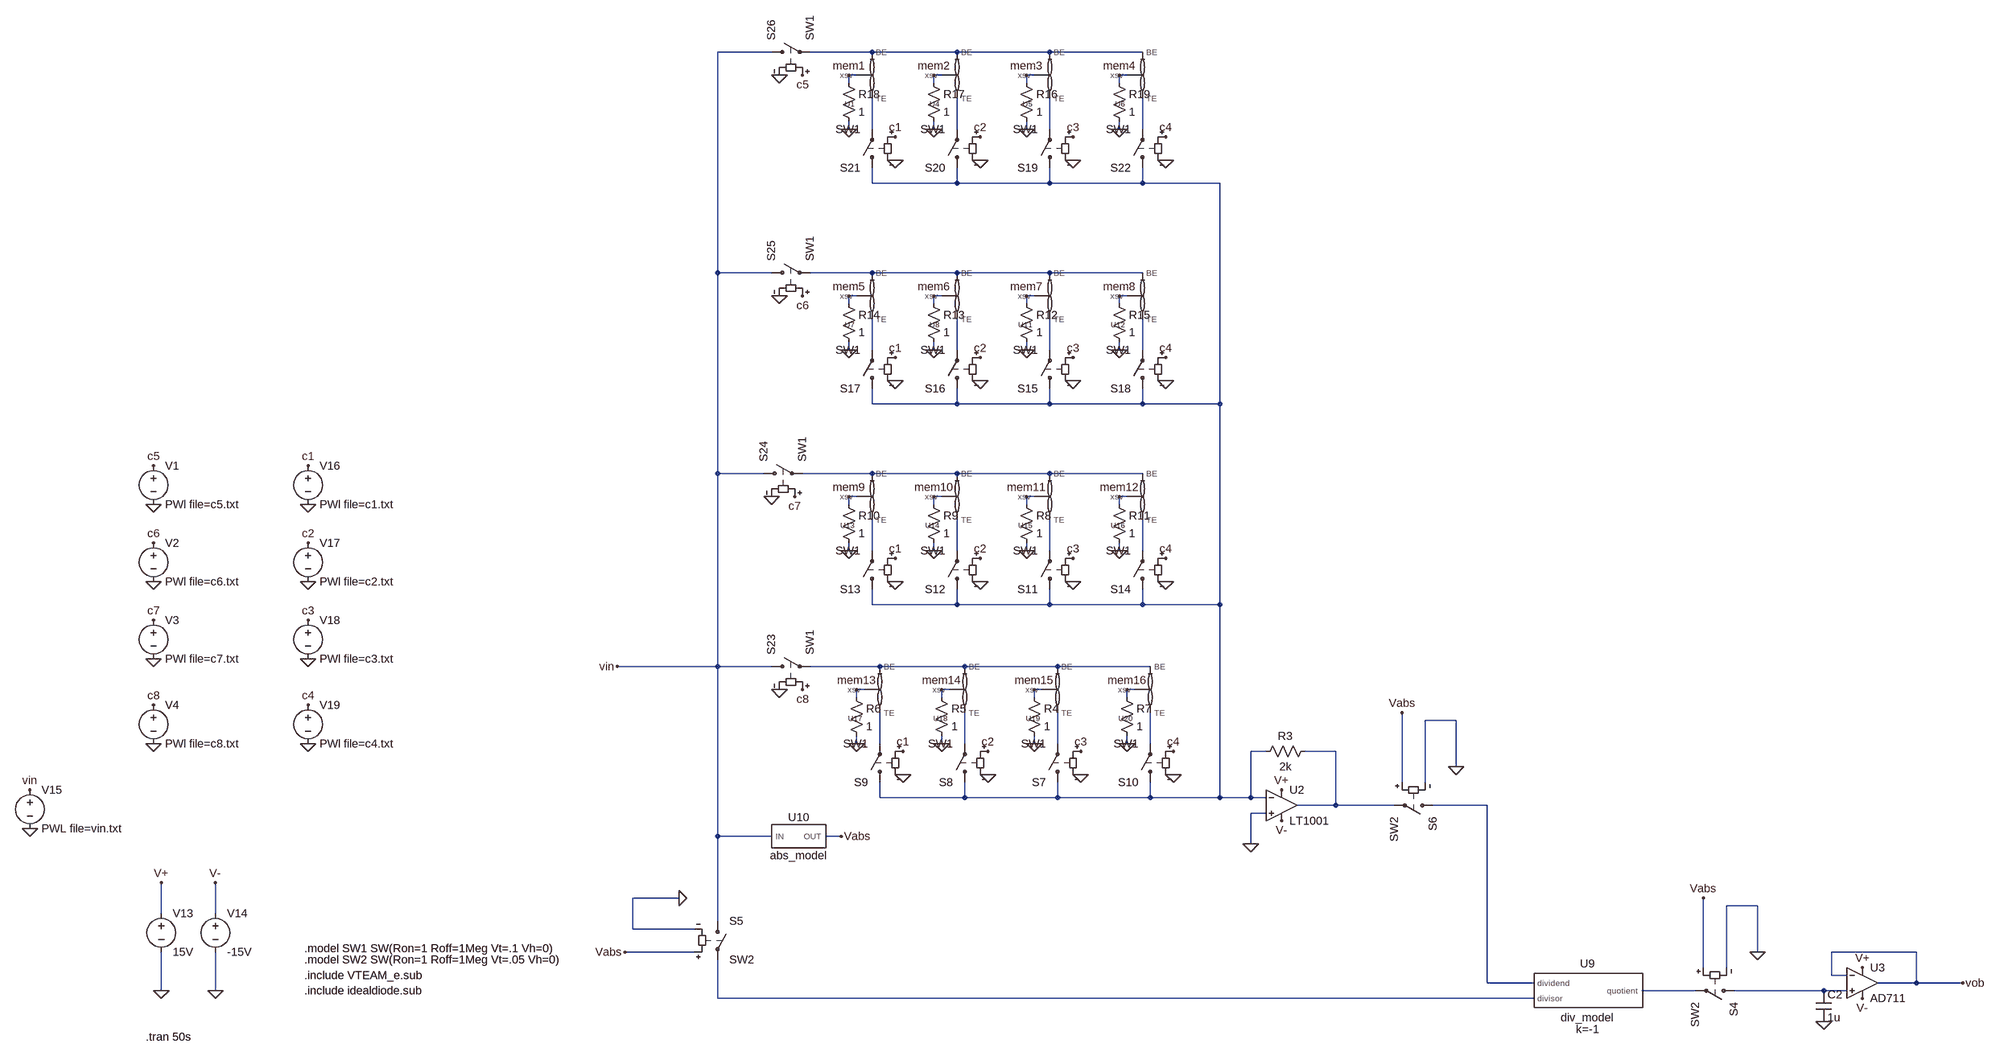
[diagram p0: schematic mem_array.asc]
mem_array.asc, the LTspice schematic file:
Version 4
SHEET 1 4180 3648
WIRE 256 1584 144 1584
WIRE 464 1584 336 1584
WIRE 640 1584 464 1584
WIRE 832 1584 640 1584
WIRE 1024 1584 832 1584
WIRE 432 1632 416 1632
WIRE 608 1632 592 1632
WIRE 800 1632 784 1632
WIRE 992 1632 976 1632
WIRE 416 1648 416 1632
WIRE 592 1648 592 1632
WIRE 784 1648 784 1632
WIRE 976 1648 976 1632
WIRE 416 1744 416 1728
WIRE 464 1744 464 1680
WIRE 592 1744 592 1728
WIRE 640 1744 640 1680
WIRE 784 1744 784 1728
WIRE 832 1744 832 1680
WIRE 976 1744 976 1728
WIRE 1024 1744 1024 1680
WIRE 464 1856 464 1824
WIRE 640 1856 640 1824
WIRE 640 1856 464 1856
WIRE 832 1856 832 1824
WIRE 832 1856 640 1856
WIRE 1024 1856 1024 1824
WIRE 1024 1856 832 1856
WIRE 1184 1856 1024 1856
WIRE 144 2048 144 1584
WIRE 256 2048 144 2048
WIRE 464 2048 336 2048
WIRE 640 2048 464 2048
WIRE 832 2048 640 2048
WIRE 1024 2048 832 2048
WIRE 432 2096 416 2096
WIRE 608 2096 592 2096
WIRE 800 2096 784 2096
WIRE 992 2096 976 2096
WIRE 416 2112 416 2096
WIRE 592 2112 592 2096
WIRE 784 2112 784 2096
WIRE 976 2112 976 2096
WIRE 416 2208 416 2192
WIRE 464 2208 464 2144
WIRE 592 2208 592 2192
WIRE 640 2208 640 2144
WIRE 784 2208 784 2192
WIRE 832 2208 832 2144
WIRE 976 2208 976 2192
WIRE 1024 2208 1024 2144
WIRE 464 2320 464 2288
WIRE 640 2320 640 2288
WIRE 640 2320 464 2320
WIRE 832 2320 832 2288
WIRE 832 2320 640 2320
WIRE 1024 2320 1024 2288
WIRE 1024 2320 832 2320
WIRE 1184 2320 1184 1856
WIRE 1184 2320 1024 2320
WIRE 144 2464 144 2048
WIRE 240 2464 144 2464
WIRE 464 2464 320 2464
WIRE 640 2464 464 2464
WIRE 832 2464 640 2464
WIRE 1024 2464 832 2464
WIRE 432 2512 416 2512
WIRE 608 2512 592 2512
WIRE 800 2512 784 2512
WIRE 992 2512 976 2512
WIRE 416 2528 416 2512
WIRE 592 2528 592 2512
WIRE 784 2528 784 2512
WIRE 976 2528 976 2512
WIRE 416 2624 416 2608
WIRE 464 2624 464 2560
WIRE 592 2624 592 2608
WIRE 640 2624 640 2560
WIRE 784 2624 784 2608
WIRE 832 2624 832 2560
WIRE 976 2624 976 2608
WIRE 1024 2624 1024 2560
WIRE 464 2736 464 2704
WIRE 640 2736 640 2704
WIRE 640 2736 464 2736
WIRE 832 2736 832 2704
WIRE 832 2736 640 2736
WIRE 1024 2736 1024 2704
WIRE 1024 2736 832 2736
WIRE 1184 2736 1184 2320
WIRE 1184 2736 1024 2736
WIRE 144 2864 144 2464
WIRE 144 2864 -64 2864
WIRE 256 2864 144 2864
WIRE 480 2864 336 2864
WIRE 656 2864 480 2864
WIRE 848 2864 656 2864
WIRE 1040 2864 848 2864
WIRE 448 2912 432 2912
WIRE 624 2912 608 2912
WIRE 816 2912 800 2912
WIRE 1008 2912 992 2912
WIRE 432 2928 432 2912
WIRE 608 2928 608 2912
WIRE 800 2928 800 2912
WIRE 992 2928 992 2912
WIRE 1680 2976 1616 2976
WIRE 432 3024 432 3008
WIRE 480 3024 480 2960
WIRE 608 3024 608 3008
WIRE 656 3024 656 2960
WIRE 800 3024 800 3008
WIRE 848 3024 848 2960
WIRE 992 3024 992 3008
WIRE 1040 3024 1040 2960
WIRE 1280 3040 1248 3040
WIRE 1424 3040 1360 3040
WIRE 1680 3072 1680 2976
WIRE 1568 3104 1568 2960
WIRE 1616 3104 1616 2976
WIRE 480 3136 480 3104
WIRE 656 3136 656 3104
WIRE 656 3136 480 3136
WIRE 848 3136 848 3104
WIRE 848 3136 656 3136
WIRE 1040 3136 1040 3104
WIRE 1040 3136 848 3136
WIRE 1184 3136 1184 2736
WIRE 1184 3136 1040 3136
WIRE 1248 3136 1248 3040
WIRE 1248 3136 1184 3136
WIRE 1280 3136 1248 3136
WIRE 1424 3152 1424 3040
WIRE 1424 3152 1344 3152
WIRE 1552 3152 1424 3152
WIRE 1744 3152 1632 3152
WIRE 1280 3168 1248 3168
WIRE 144 3216 144 2864
WIRE 256 3216 144 3216
WIRE 400 3216 368 3216
WIRE 1248 3232 1248 3168
WIRE 64 3344 -32 3344
WIRE 2304 3360 2240 3360
WIRE -1008 3376 -1008 3312
WIRE -896 3376 -896 3312
WIRE 144 3392 144 3216
WIRE -32 3408 -32 3344
WIRE 96 3408 -32 3408
WIRE 96 3456 -48 3456
WIRE 2304 3456 2304 3360
WIRE 2640 3456 2464 3456
WIRE 2192 3488 2192 3344
WIRE 2240 3488 2240 3360
WIRE 2464 3504 2464 3456
WIRE 2496 3504 2464 3504
WIRE 1744 3520 1744 3152
WIRE 1840 3520 1744 3520
WIRE 2640 3520 2640 3456
WIRE 2640 3520 2560 3520
WIRE 2736 3520 2640 3520
WIRE -1008 3536 -1008 3456
WIRE -896 3536 -896 3456
WIRE 2176 3536 2064 3536
WIRE 2448 3536 2256 3536
WIRE 2496 3536 2448 3536
WIRE 144 3552 144 3472
WIRE 1840 3552 144 3552
FLAG 2304 3456 0
FLAG 2528 3488 V+
FLAG 2528 3552 V-
FLAG 64 3344 0
FLAG 1680 3072 0
FLAG 400 3216 Vabs
FLAG -48 3456 Vabs
FLAG 1568 2960 Vabs
FLAG 2192 3344 Vabs
FLAG 1248 3232 0
FLAG -896 3536 0
FLAG -1008 3536 0
FLAG -1008 3312 V+
FLAG -896 3312 V-
FLAG 1312 3120 V+
FLAG 1312 3184 V-
FLAG -1280 3200 0
FLAG -1280 3120 vin
FLAG -704 2528 0
FLAG -704 2688 0
FLAG -704 2848 0
FLAG -704 2448 c1
FLAG -704 2608 c2
FLAG -704 2768 c3
FLAG -64 2864 vin
FLAG 2448 3600 0
FLAG 800 3024 0
FLAG 896 3088 0
FLAG 896 3040 c3
FLAG 608 3024 0
FLAG 704 3088 0
FLAG 704 3040 c2
FLAG 432 3024 0
FLAG 528 3088 0
FLAG 528 3040 c1
FLAG 992 3024 0
FLAG 1088 3088 0
FLAG 1088 3040 c4
FLAG -704 3024 0
FLAG -704 2944 c4
FLAG 784 2624 0
FLAG 880 2688 0
FLAG 880 2640 c3
FLAG 592 2624 0
FLAG 688 2688 0
FLAG 688 2640 c2
FLAG 416 2624 0
FLAG 512 2688 0
FLAG 512 2640 c1
FLAG 976 2624 0
FLAG 1072 2688 0
FLAG 1072 2640 c4
FLAG 784 2208 0
FLAG 880 2272 0
FLAG 880 2224 c3
FLAG 592 2208 0
FLAG 688 2272 0
FLAG 688 2224 c2
FLAG 416 2208 0
FLAG 512 2272 0
FLAG 512 2224 c1
FLAG 976 2208 0
FLAG 1072 2272 0
FLAG 1072 2224 c4
FLAG 784 1744 0
FLAG 880 1808 0
FLAG 880 1760 c3
FLAG 592 1744 0
FLAG 688 1808 0
FLAG 688 1760 c2
FLAG 416 1744 0
FLAG 512 1808 0
FLAG 512 1760 c1
FLAG 976 1744 0
FLAG 1072 1808 0
FLAG 1072 1760 c4
FLAG 272 2912 0
FLAG 320 2912 c8
FLAG 256 2512 0
FLAG 304 2512 c7
FLAG 272 2096 0
FLAG 320 2096 c6
FLAG 272 1632 0
FLAG 320 1632 c5
FLAG -1024 2528 0
FLAG -1024 2688 0
FLAG -1024 2848 0
FLAG -1024 2448 c5
FLAG -1024 2608 c6
FLAG -1024 2768 c7
FLAG -1024 3024 0
FLAG -1024 2944 c8
FLAG 2736 3520 vob
FLAG 416 1632 mem1
FLAG 592 1632 mem2
FLAG 784 1632 mem3
FLAG 976 1632 mem4
FLAG 416 2096 mem5
FLAG 592 2096 mem6
FLAG 784 2096 mem7
FLAG 976 2096 mem8
FLAG 416 2512 mem9
FLAG 592 2512 mem10
FLAG 784 2512 mem11
FLAG 976 2512 mem12
FLAG 432 2912 mem13
FLAG 608 2912 mem14
FLAG 800 2912 mem15
FLAG 992 2912 mem16
SYMBOL OpAmps\\LT1001 1312 3088 R0
SYMATTR InstName U2
SYMBOL res 1376 3024 R90
WINDOW 0 0 56 VBottom 2
WINDOW 3 32 56 VTop 2
SYMATTR InstName R3
SYMATTR Value 2k
SYMBOL OpAmps\\AD711 2528 3456 R0
SYMATTR InstName U3
SYMBOL sw 2272 3536 R90
SYMATTR InstName S4
SYMATTR Value SW2
SYMBOL sw 144 3376 R0
SYMATTR InstName S5
SYMATTR Value SW2
SYMBOL sw 1648 3152 R90
SYMATTR InstName S6
SYMATTR Value SW2
SYMBOL AutoGenerated\\div_model 1952 3536 R0
SYMATTR InstName U9
SYMATTR SpiceLine k=-1
SYMBOL AutoGenerated\\abs_model 304 3216 R0
SYMATTR InstName U10
SYMBOL voltage -1008 3360 R0
SYMATTR InstName V13
SYMATTR Value 15V
SYMBOL voltage -896 3360 R0
WINDOW 123 0 0 Left 0
WINDOW 39 0 0 Left 0
SYMATTR InstName V14
SYMATTR Value -15V
SYMBOL voltage -1280 3104 R0
WINDOW 123 0 0 Left 0
WINDOW 39 0 0 Left 0
SYMATTR InstName V15
SYMATTR Value PWL file=vin.txt
SYMBOL voltage -704 2432 R0
WINDOW 123 0 0 Left 0
WINDOW 39 0 0 Left 0
SYMATTR InstName V16
SYMATTR Value PWl file=c1.txt
SYMBOL voltage -704 2592 R0
WINDOW 123 0 0 Left 0
WINDOW 39 0 0 Left 0
SYMATTR InstName V17
SYMATTR Value PWl file=c2.txt
SYMBOL voltage -704 2752 R0
SYMATTR InstName V18
SYMATTR Value PWl file=c3.txt
SYMBOL cap 2432 3536 R0
SYMATTR InstName C2
SYMATTR Value 1u
SYMBOL res 784 2912 R0
SYMATTR InstName R4
SYMATTR Value 1
SYMBOL sw 848 3120 R180
SYMATTR InstName S7
SYMATTR Value SW1
SYMBOL res 592 2912 R0
SYMATTR InstName R5
SYMATTR Value 1
SYMBOL sw 656 3120 R180
SYMATTR InstName S8
SYMATTR Value SW1
SYMBOL res 416 2912 R0
SYMATTR InstName R6
SYMATTR Value 1
SYMBOL sw 480 3120 R180
SYMATTR InstName S9
SYMATTR Value SW1
SYMBOL res 976 2912 R0
SYMATTR InstName R7
SYMATTR Value 1
SYMBOL sw 1040 3120 R180
SYMATTR InstName S10
SYMATTR Value SW1
SYMBOL voltage -704 2928 R0
SYMATTR InstName V19
SYMATTR Value PWl file=c4.txt
SYMBOL res 768 2512 R0
SYMATTR InstName R8
SYMATTR Value 1
SYMBOL sw 832 2720 R180
SYMATTR InstName S11
SYMATTR Value SW1
SYMBOL res 576 2512 R0
SYMATTR InstName R9
SYMATTR Value 1
SYMBOL sw 640 2720 R180
SYMATTR InstName S12
SYMATTR Value SW1
SYMBOL res 400 2512 R0
SYMATTR InstName R10
SYMATTR Value 1
SYMBOL sw 464 2720 R180
SYMATTR InstName S13
SYMATTR Value SW1
SYMBOL res 960 2512 R0
SYMATTR InstName R11
SYMATTR Value 1
SYMBOL sw 1024 2720 R180
SYMATTR InstName S14
SYMATTR Value SW1
SYMBOL res 768 2096 R0
SYMATTR InstName R12
SYMATTR Value 1
SYMBOL sw 832 2304 R180
SYMATTR InstName S15
SYMATTR Value SW1
SYMBOL res 576 2096 R0
SYMATTR InstName R13
SYMATTR Value 1
SYMBOL sw 640 2304 R180
SYMATTR InstName S16
SYMATTR Value SW1
SYMBOL res 400 2096 R0
SYMATTR InstName R14
SYMATTR Value 1
SYMBOL sw 464 2304 R180
SYMATTR InstName S17
SYMATTR Value SW1
SYMBOL res 960 2096 R0
SYMATTR InstName R15
SYMATTR Value 1
SYMBOL sw 1024 2304 R180
SYMATTR InstName S18
SYMATTR Value SW1
SYMBOL res 768 1632 R0
SYMATTR InstName R16
SYMATTR Value 1
SYMBOL sw 832 1840 R180
SYMATTR InstName S19
SYMATTR Value SW1
SYMBOL res 576 1632 R0
SYMATTR InstName R17
SYMATTR Value 1
SYMBOL sw 640 1840 R180
SYMATTR InstName S20
SYMATTR Value SW1
SYMBOL res 400 1632 R0
SYMATTR InstName R18
SYMATTR Value 1
SYMBOL sw 464 1840 R180
SYMATTR InstName S21
SYMATTR Value SW1
SYMBOL res 960 1632 R0
SYMATTR InstName R19
SYMATTR Value 1
SYMBOL sw 1024 1840 R180
SYMATTR InstName S22
SYMATTR Value SW1
SYMBOL sw 240 2864 R270
SYMATTR InstName S23
SYMATTR Value SW1
SYMBOL sw 224 2464 R270
SYMATTR InstName S24
SYMATTR Value SW1
SYMBOL sw 240 2048 R270
SYMATTR InstName S25
SYMATTR Value SW1
SYMBOL sw 240 1584 R270
SYMATTR InstName S26
SYMATTR Value SW1
SYMBOL memristor_with_state 464 1632 R180
SYMATTR InstName U1
SYMATTR Value VTEAM_e
SYMBOL memristor_with_state 640 1632 R180
SYMATTR InstName U4
SYMATTR Value VTEAM_e
SYMBOL memristor_with_state 832 1632 R180
SYMATTR InstName U5
SYMATTR Value VTEAM_e
SYMBOL memristor_with_state 1024 1632 R180
SYMATTR InstName U6
SYMATTR Value VTEAM_e
SYMBOL memristor_with_state 464 2096 R180
SYMATTR InstName U7
SYMATTR Value VTEAM_e
SYMBOL memristor_with_state 640 2096 R180
SYMATTR InstName U8
SYMATTR Value VTEAM_e
SYMBOL memristor_with_state 832 2096 R180
SYMATTR InstName U11
SYMATTR Value VTEAM_e
SYMBOL memristor_with_state 1024 2096 R180
SYMATTR InstName U12
SYMATTR Value VTEAM_e
SYMBOL memristor_with_state 464 2512 R180
SYMATTR InstName U13
SYMATTR Value VTEAM_e
SYMBOL memristor_with_state 640 2512 R180
SYMATTR InstName U14
SYMATTR Value VTEAM_e
SYMBOL memristor_with_state 832 2512 R180
SYMATTR InstName U15
SYMATTR Value VTEAM_e
SYMBOL memristor_with_state 1024 2512 R180
SYMATTR InstName U16
SYMATTR Value VTEAM_e
SYMBOL memristor_with_state 480 2912 R180
SYMATTR InstName U17
SYMATTR Value VTEAM_e
SYMBOL memristor_with_state 656 2912 R180
SYMATTR InstName U18
SYMATTR Value VTEAM_e
SYMBOL memristor_with_state 848 2912 R180
SYMATTR InstName U19
SYMATTR Value VTEAM_e
SYMBOL memristor_with_state 1040 2912 R180
SYMATTR InstName U20
SYMATTR Value VTEAM_e
SYMBOL voltage -1024 2432 R0
WINDOW 123 0 0 Left 0
WINDOW 39 0 0 Left 0
SYMATTR InstName V1
SYMATTR Value PWl file=c5.txt
SYMBOL voltage -1024 2592 R0
WINDOW 123 0 0 Left 0
WINDOW 39 0 0 Left 0
SYMATTR InstName V2
SYMATTR Value PWl file=c6.txt
SYMBOL voltage -1024 2752 R0
SYMATTR InstName V3
SYMATTR Value PWl file=c7.txt
SYMBOL voltage -1024 2928 R0
SYMATTR InstName V4
SYMATTR Value PWl file=c8.txt
TEXT -712 3448 Left 2 !.model SW1 SW(Ron=1 Roff=1Meg Vt=.1 Vh=0)
TEXT -712 3504 Left 2 !.include VTEAM_e.sub
TEXT -712 3536 Left 2 !.include idealdiode.sub
TEXT -712 3472 Left 2 !.model SW2 SW(Ron=1 Roff=1Meg Vt=.05 Vh=0)
TEXT -1040 3632 Left 2 !.tran 50s

The netlist it stands for:
* mem_array.asc
XU2 0 N006 V+ V- N022 LT1001  ; pins In+ In- V+ V- OUT
R3 N022 N006 2k
XU3 N025 vob V+ V- vob AD712  ; AD711, pins In+ In- V+ V- OUT
S4 N025 N024 Vabs 0 SW2
S5 vin N026 Vabs 0 SW2
S6 N023 N022 Vabs 0 SW2
XU9 N023 N026 N024 div_model k=-1  ; pins dividend divisor quotient
XU10 vin Vabs abs_model  ; pins IN OUT
V13 V+ 0 15V
V14 V- 0 -15V
V15 vin 0 PWL file=vin.txt
V16 c1 0 PWl file=c1.txt
V17 c2 0 PWl file=c2.txt
V18 c3 0 PWl file=c3.txt
C2 N025 0 1u
R4 mem15 0 1
S7 N006 N020 c3 0 SW1
R5 mem14 0 1
S8 N006 N019 c2 0 SW1
R6 mem13 0 1
S9 N006 N018 c1 0 SW1
R7 mem16 0 1
S10 N006 N021 c4 0 SW1
V19 c4 0 PWl file=c4.txt
R8 mem11 0 1
S11 N006 N015 c3 0 SW1
R9 mem10 0 1
S12 N006 N014 c2 0 SW1
R10 mem9 0 1
S13 N006 N013 c1 0 SW1
R11 mem12 0 1
S14 N006 N016 c4 0 SW1
R12 mem7 0 1
S15 N006 N010 c3 0 SW1
R13 mem6 0 1
S16 N006 N009 c2 0 SW1
R14 mem5 0 1
S17 N006 N008 c1 0 SW1
R15 mem8 0 1
S18 N006 N011 c4 0 SW1
R16 mem3 0 1
S19 N006 N004 c3 0 SW1
R17 mem2 0 1
S20 N006 N003 c2 0 SW1
R18 mem1 0 1
S21 N006 N002 c1 0 SW1
R19 mem4 0 1
S22 N006 N005 c4 0 SW1
S23 vin N017 c8 0 SW1
S24 vin N012 c7 0 SW1
S25 vin N007 c6 0 SW1
S26 vin N001 c5 0 SW1
XU1 N002 N001 mem1 VTEAM_e  ; pins TE BE xsv
XU4 N003 N001 mem2 VTEAM_e  ; pins TE BE xsv
XU5 N004 N001 mem3 VTEAM_e  ; pins TE BE xsv
XU6 N005 N001 mem4 VTEAM_e  ; pins TE BE xsv
XU7 N008 N007 mem5 VTEAM_e  ; pins TE BE xsv
XU8 N009 N007 mem6 VTEAM_e  ; pins TE BE xsv
XU11 N010 N007 mem7 VTEAM_e  ; pins TE BE xsv
XU12 N011 N007 mem8 VTEAM_e  ; pins TE BE xsv
XU13 N013 N012 mem9 VTEAM_e  ; pins TE BE xsv
XU14 N014 N012 mem10 VTEAM_e  ; pins TE BE xsv
XU15 N015 N012 mem11 VTEAM_e  ; pins TE BE xsv
XU16 N016 N012 mem12 VTEAM_e  ; pins TE BE xsv
XU17 N018 N017 mem13 VTEAM_e  ; pins TE BE xsv
XU18 N019 N017 mem14 VTEAM_e  ; pins TE BE xsv
XU19 N020 N017 mem15 VTEAM_e  ; pins TE BE xsv
XU20 N021 N017 mem16 VTEAM_e  ; pins TE BE xsv
V1 c5 0 PWl file=c5.txt
V2 c6 0 PWl file=c6.txt
V3 c7 0 PWl file=c7.txt
V4 c8 0 PWl file=c8.txt
.model SW1 SW(Ron=1 Roff=1Meg Vt=.1 Vh=0)
.include VTEAM_e.sub
.include idealdiode.sub
.model SW2 SW(Ron=1 Roff=1Meg Vt=.05 Vh=0)
.tran 50s
.lib LTC.lib
.lib ADI1.lib
.lib C:\Users\ASUS\Desktop\Memristor_model\division_model\div_model.sub
.lib C:\Users\ASUS\Desktop\Memristor_model\abs_model\abs_model.sub
.backanno
.end